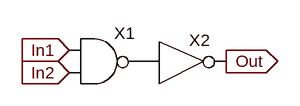
[diagram p0: schematic AND2.asc]
AND2.asc, the LTspice schematic file:
Version 4
SHEET 1 1136 680
FLAG 592 272 Out
IOPIN 592 272 Out
FLAG 368 256 In1
IOPIN 368 256 In
FLAG 368 288 In2
IOPIN 368 288 In
SYMBOL NAND2 416 208 R0
SYMATTR InstName X1
SYMBOL NOT 496 240 R0
SYMATTR InstName X2

The netlist it stands for:
* AND2.asc
XX1 In1 In2 P001 NAND2  ; pins In1 In2 Out
XX2 P001 Out NOT  ; pins In Out
.backanno
.end